# EAGLE schematic item_2022_BlockDiagram_01 (EAGLE 9.6.2)
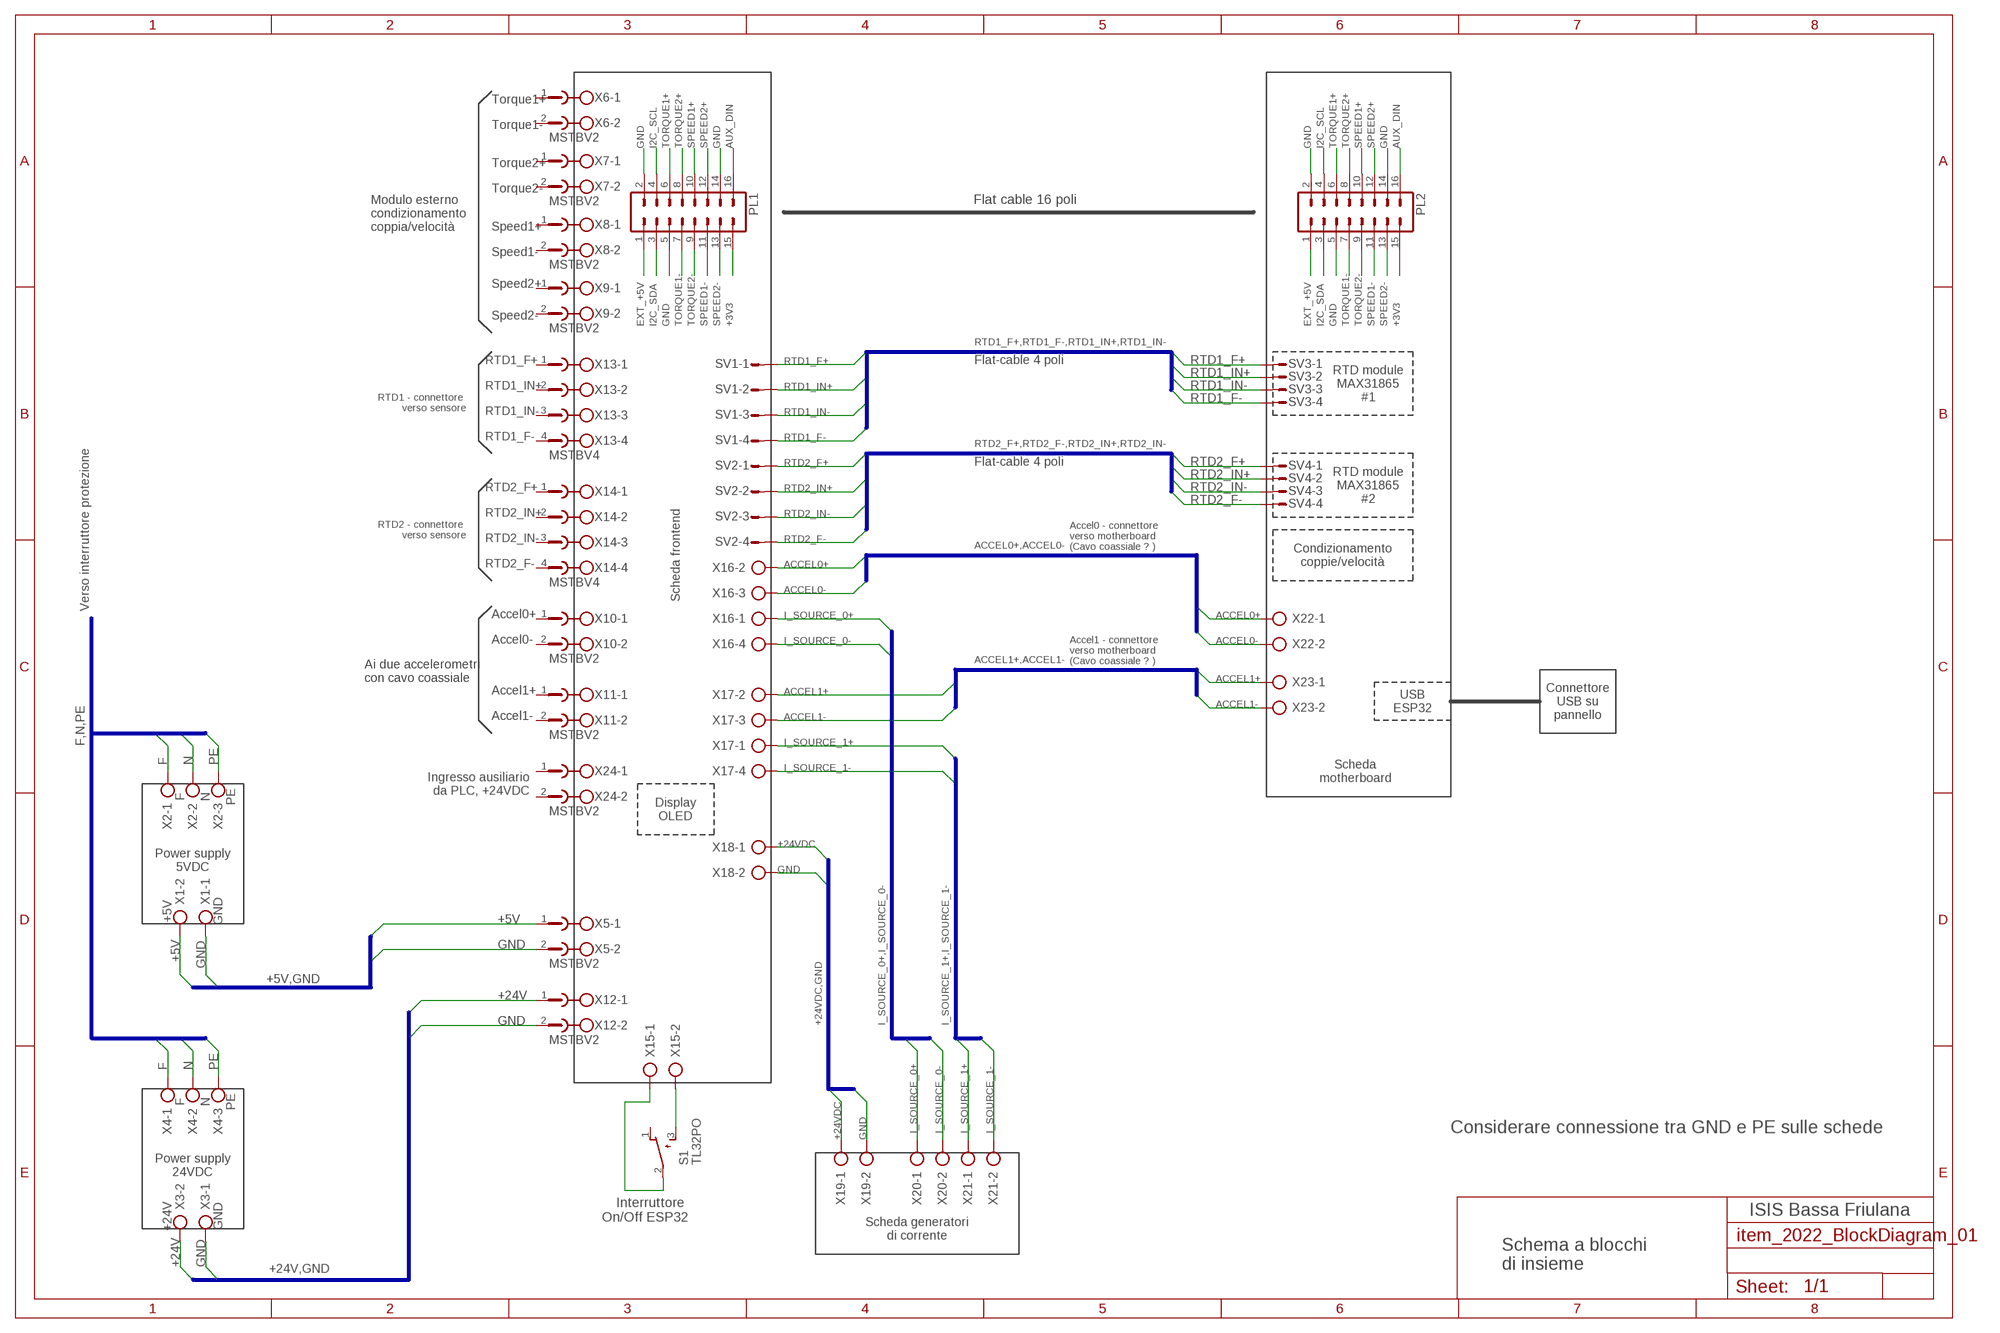
[diagram p0: schematic, sheet 1]

## Parts
PL1  16V  [16V]
PL2  16V  [16V]
S1  TL32PO  [TL3XPO]
SV1  S04P  [S04P]
SV2  S04P  [S04P]
SV3  S04P  [S04P]
SV4  S04P  [S04P]
X1  +5V  AK500/2  [AK500/2]
X2  AK500/3  [AK500/3]
X3  +5V  AK500/2  [AK500/2]
X4  AK500/3  [AK500/3]
X5  MSTBV2  [MSTBV2]
X6  MSTBV2  [MSTBV2]
X7  MSTBV2  [MSTBV2]
X8  MSTBV2  [MSTBV2]
X9  MSTBV2  [MSTBV2]
X10  MSTBV2  [MSTBV2]
X11  MSTBV2  [MSTBV2]
X12  MSTBV2  [MSTBV2]
X13  MSTBV4  [MSTBV4]
X14  MSTBV4  [MSTBV4]
X15  AK500/2  [AK500/2]
X16  AK500/4  [AK500/4]
X17  AK500/4  [AK500/4]
X18  AK500/2  [AK500/2]
X19  AK500/2  [AK500/2]
X20  AK500/2  [AK500/2]
X21  AK500/2  [AK500/2]
X22  AK500/2  [AK500/2]
X23  AK500/2  [AK500/2]
X24  MSTBV2  [MSTBV2]

## Nets
+3V3: PL1.15 PL2.15
+5V: X1.2 X5.1
+24V: X3.2 X12.1
+24VDC: X18.1 X19.1
ACCEL0+: X16.2 X22.1
ACCEL0-: X16.3 X22.2
ACCEL1+: X17.2 X23.1
ACCEL1-: X17.3 X23.2
AUX_DIN: PL1.16 PL2.16
EXT_+5V: PL1.1 PL2.1
F: X2.1 X4.1
GND: PL1.2 PL1.5 PL1.14 PL2.2 PL2.5 PL2.14 X1.1 X3.1 X5.2 X12.2 X18.2 X19.2
I2C_SCL: PL1.4 PL2.4
I2C_SDA: PL1.3 PL2.3
I_SOURCE_0+: X16.1 X20.1
I_SOURCE_0-: X16.4 X20.2
I_SOURCE_1+: X17.1 X21.1
I_SOURCE_1-: X17.4 X21.2
N: X2.2 X4.2
N$1: S1.3(S) X15.2
N$2: S1.2(P) X15.1
PE: X2.3 X4.3
RTD1_F+: SV1.1 SV3.1
RTD1_F-: SV1.4 SV3.4
RTD1_IN+: SV1.2 SV3.2
RTD1_IN-: SV1.3 SV3.3
RTD2_F+: SV2.1 SV4.1
RTD2_F-: SV2.4 SV4.4
RTD2_IN+: SV2.2 SV4.2
RTD2_IN-: SV2.3 SV4.3
SPEED1+: PL1.10 PL2.10
SPEED1-: PL1.11 PL2.11
SPEED2+: PL1.12 PL2.12
SPEED2-: PL1.13 PL2.13
TORQUE1+: PL1.6 PL2.6
TORQUE1-: PL1.7 PL2.7
TORQUE2+: PL1.8 PL2.8
TORQUE2-: PL1.9 PL2.9
Unconnected: S1.1(O) X6.1 X6.2 X7.1 X7.2 X8.1 X8.2 X9.1 X9.2 X10.1 X10.2 X11.1 X11.2 X13.1 X13.2 X13.3 X13.4 X14.1 X14.2 X14.3 X14.4 X24.1 X24.2

## Buses
F,N,PE
+5V,GND
+24V,GND
+24VDC,GND
I_SOURCE_0+,I_SOURCE_0-
I_SOURCE_1+,I_SOURCE_1-
RTD1_F+,RTD1_F-,RTD1_IN+,RTD1_IN-
RTD2_F+,RTD2_F-,RTD2_IN+,RTD2_IN-
ACCEL0+,ACCEL0-
ACCEL1+,ACCEL1-

## Notes on the sheet
- Torque1+
- Torque1-
- Torque2+
- Torque2-
- Flat cable 16 poli
- Modulo esterno
  condizionamento
  coppia/velocità
- Speed1+
- Speed1-
- Speed2+
- Speed2-
- RTD1_F+ | Flat-cable 4 poli
- RTD module
  MAX31865
  #1
- RTD1_IN+
- RTD1 - connettore 
  verso sensore
- RTD1_IN-
- RTD1_F-
- Flat-cable 4 poli
- RTD module
  MAX31865
  #2
- RTD2_F+
- RTD2_IN+
- Verso interruttore protezione
- RTD2 - connettore 
  verso sensore
- Accel0 - connettore 
  verso motherboard
  (Cavo coassiale ? )
- RTD2_IN-
- Scheda frontend
- Condizionamento
  coppie/velocità
- RTD2_F-
- Accel0+
- Accel0-
- Accel1 - connettore 
  verso motherboard
  (Cavo coassiale ? )
- Ai due accelerometri
  con cavo coassiale
- Accel1+
- USB
  ESP32
- Connettore
  USB su
  pannello
- Accel1-
- Scheda
  motherboard
- Ingresso ausiliario
  da PLC, +24VDC
- F | N | PE
- Display
  OLED
- Power supply
  5VDC
- +5V | GND
- F | N | PE
- Considerare connessione tra GND e PE sulle schede
- Power supply
  24VDC
- Interruttore 
  On/Off ESP32
- +24V | GND | ISIS Bassa Friulana
- Scheda generatori
  di corrente
- Schema a blocchi
  di insieme

## Library data of the parts
PL1 PL2 = con-harting-v:16V: CONNECTOR; OC_FARNELL: unknown; OC_NEWARK: unknown
S1 = switch:TL32PO: TINY SWITCH ON - MOM Source: http://www2.produktinfo.conrad.com/datenblaetter/700000-724999/705152-da-01-de-Subminiaturschalter_TL_36YO.pdf
SV1-SV4 = con-amp-mt:S04P: AMP MT CONNECTOR; OC_FARNELL: unknown; OC_NEWARK: unknown
X1 X3 X15 X18-X23 = con-ptr500:AK500/2: CONNECTOR; OC_FARNELL: unknown; OC_NEWARK: unknown
X2 X4 = con-ptr500:AK500/3: CONNECTOR; OC_FARNELL: unknown; OC_NEWARK: unknown
X5-X12 X24 = con-phoenix-508:MSTBV2: PHOENIX; MPN: MSTBV 2,5/2-GF-5.08; OC_FARNELL: 1792792; OC_NEWARK: 69R9845
X13 X14 = con-phoenix-508:MSTBV4: PHOENIX; MPN: MSTBV 2,5/4-GF-5.08; OC_FARNELL: 1792794; OC_NEWARK: 69R9847
X16 X17 = con-ptr500:AK500/4: CONNECTOR; OC_FARNELL: unknown; OC_NEWARK: unknown